# Altium schematic sheet MCU.SchDoc
size A3; DocumentNumber: 2; SheetNumber: 2; SheetTotal: 2
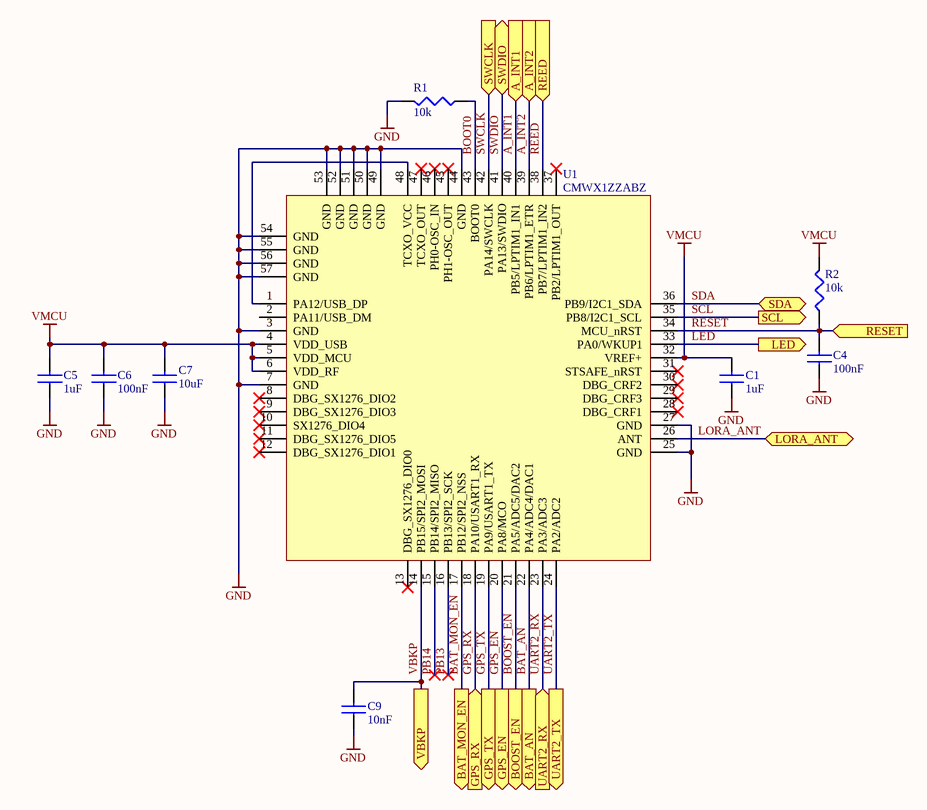
[diagram p0: MCU.SchDoc]

## Parts
C1  1uF  [CAP0402]
C4  100nF  [CAP0402]
C5  1uF  [CAP0402]
C6  100nF  [CAP0402]
C7  10uF  [CAP0603]
C9  10nF  [CAP0402]
R1  10k  [RES0402]
R2  10k  [RES0402]
U1  CMWX1ZZABZ  [Lora Module ES0]

## Ports
A_INT1 (in), A_INT2 (in), BAT_AN (out), BAT_MON_EN (out), BOOST_EN (out), GPS_EN (out), GPS_RX (in), GPS_TX (out), LED (out), LORA_ANT (bidir), REED (in), RESET (in), SCL (out), SDA (bidir), SWCLK (in), SWDIO (bidir), UART2_RX (in), UART2_TX (out), VBKP (out)

## Nets
GND: C1.1 C4.1 C5.1 C6.1 C7.1 C9.1 R1.2 U1.3(GND) U1.7(GND) U1.25(GND) U1.27(GND) U1.44(GND) U1.49(GND) U1.50(GND) U1.51(GND) U1.52(GND) U1.53(GND) U1.54(GND) U1.55(GND) U1.56(GND) U1.57(GND)
VMCU: C1.2 C5.2 C6.2 C7.2 R2.2 U1.4(VDD_USB) U1.5(VDD_MCU) U1.6(VDD_RF) U1.32(VREF+)
A_INT1: U1.40(PB5/LPTIM1_IN1) ; port A_INT1
A_INT2: U1.39(PB6/LPTIM1_ETR) ; port A_INT2
BAT_AN: U1.22(PA4/ADC4/DAC1) ; port BAT_AN
BAT_MON_EN: U1.17(PB12/SPI2_NSS) ; port BAT_MON_EN
BOOST_EN: U1.21(PA5/ADC5/DAC2) ; port BOOST_EN
BOOT0: R1.1 U1.43(BOOT0)
GPS_EN: U1.20(PA8/MCO) ; port GPS_EN
GPS_RX: U1.18(PA10/USART1_RX) ; port GPS_RX
GPS_TX: U1.19(PA9/USART1_TX) ; port GPS_TX
LED: U1.33(PA0/WKUP1) ; port LED
LORA_ANT: U1.26(ANT) ; port LORA_ANT
PB13: U1.16(PB13/SPI2_SCK)
PB14: U1.15(PB14/SPI2_MISO)
REED: U1.38(PB7/LPTIM1_IN2) ; port REED
RESET: C4.2 R2.1 U1.34(MCU_nRST) ; port RESET
SCL: U1.35(PB8/I2C1_SCL) ; port SCL
SDA: U1.36(PB9/I2C1_SDA) ; port SDA
SWCLK: U1.42(PA14/SWCLK) ; port SWCLK
SWDIO: U1.41(PA13/SWDIO) ; port SWDIO
UART2_RX: U1.23(PA3/ADC3) ; port UART2_RX
UART2_TX: U1.24(PA2/ADC2) ; port UART2_TX
VBKP: C9.2 U1.14(PB15/SPI2_MOSI) ; port VBKP
NetU1_1: U1.1(PA12/USB_DP) U1.48(TCXO_VCC)

Not connected (* = marked no-connect by the designer): U1 2(PA11/USB_DM) 8(DBG_SX1276_DIO2)* 9(DBG_SX1276_DIO3)* 10(SX1276_DIO4)* 11(DBG_SX1276_DIO5)* 12(DBG_SX1276_DIO1)* 13(DBG_SX1276_DIO0)* 28(DBG_CRF1)* 29(DBG_CRF3)* 30(DBG_CRF2)* 31(STSAFE_nRST)* 37(PB2/LPTIM1_OUT)* 45(PH1-OSC_OUT)* 46(PH0-OSC_IN)* 47(TCXO_OUT)*

## Notes on the sheet
- Size: A3
- Revision:
- Sheet
- of

## Library data of the parts
C1 C5 = C - 1uF/0402: CAP CER 1UF 10V 20% X5R 0402; Manufacturer: Murata; Manufacturer Part Number: GRM155R61A105ME15D; IRNAS Part No.: /; Stock 1: 0; Pricing 1: 10=0.0379, 100=0.0266, 500=0.0156, 2500=0.0098, 5000=0.0083 (EUR); Mount: Surface Mount; Case/Package: 0402; Case Code (Metric): 1005; Case Code (Imperial): 0402; Min Operating Temperature: -55°C; Max Operating Temperature: 85°C; Capacitance: 1uF; Tolerance: 20%; Voltage Rating: 10V; Packaging: Tape and Reel; Package Quantity: 1; Dielectric: X5R; Voltage: 10V; Voltage Rating (DC): 10V; Length: 1mm; Height: 0.5mm; Width: 0.02inch; Thickness: 0.022inch; Depth: 0.5mm; Radiation Hardening: No; REACH SVHC: No SVHC; Lead Free: Lead Free; ComponentLink1URL: https://datasheet.ciiva.com/164/product-164665.pdf; ComponentLink1Description: https://datasheet.ciiva.com/164/product-164665.pdf; ComponentLink2URL: https://datasheet.ciiva.com/11616/product-11616508.pdf; ComponentLink2Description: https://datasheet.ciiva.com/11616/product-11616508.pdf; ComponentLink3URL: https://datasheet.ciiva.com/46418/1769893-46418047.pdf; ComponentLink3Description: https://datasheet.ciiva.com/46418/1769893-46418047.pdf; ComponentLink4URL: https://datasheet.ciiva.com/164/partnumbering-e-01-164666.pdf; ComponentLink4Description: https://datasheet.ciiva.com/164/partnumbering-e-01-164666.pdf; ComponentLink5URL: https://datasheet.ciiva.com/164/partnumbering-e-01-164667.pdf; ComponentLink5Description: https://datasheet.ciiva.com/164/partnumbering-e-01-164667.pdf; Supplier 1: Farnell; Supplier Part Number 1: 1740588
C4 C6 = C - 100nF/0402: MULTICOMP         MC0402X104J160CT             SMD Multilayer Ceramic Capacitor, 0402 [1005 Metric], 0.1 F, 16 V,  5%, X5R, MC Series                          New; IRNAS Part No.: /; Voltage Rating: 16V; Supplier 1: Farnell; Manufacturer: Multicomp; Manufacturer Part Number: MC0402X104J160CT; Stock 1: 3230; Pricing 1: 10=0.0139, 100=0.0108, 500=0.0076, 2500=0.0051, 5000=0.0038 (EUR); Case Code (Metric): 1005; Case Code (Imperial): 0402; Min Operating Temperature: -55°C; Max Operating Temperature: 85°C; Capacitance: 100nF; Dielectric: X5R; Packaging: Tape and Reel; Tolerance: 5%; Voltage Rating (DC): 16V; REACH SVHC: No SVHC; ComponentLink1URL: http://www.farnell.com/datasheets/2117933.pdf; ComponentLink1Description: http://www.farnell.com/datasheets/2117933.pdf; ComponentLink2URL: http://www.farnell.com/datasheets/2117900.pdf; ComponentLink2Description: http://www.farnell.com/datasheets/2117900.pdf; Supplier Part Number 1: 2627419
C7 = 10uF: 10uf/0603/20%; Manufacturer: KEMET; Manufacturer Part Number: C0603C106M8PACTU; Stock 1: 0; Pricing 1: 10=0.555, 100=0.315, 500=0.238, 1000=0.2, 2000=0.174, 4000=0.143, 20000=0.123 (GBP); Supplier 1: Farnell; Supplier Part Number 1: 2456110
C9 = C - 10nF/0402: CAP CER 10000PF 16V X7R 0402; Manufacturer: Murata; Manufacturer Part Number: GRM155R71C103KA01D; IRNAS Part No.: /; Tolerance: 10%; Supplier 1: Farnell; Stock 1: 16478; Pricing 1: 10=0.0216, 100=0.0151, 500=0.0104, 2500=0.0069, 5000=0.0056 (EUR); Mount: Surface Mount; Case/Package: 0402; Number of Pins: 2; Case Code (Metric): 1005; Case Code (Imperial): 0402; Min Operating Temperature: -55°C; Max Operating Temperature: 125°C; Package Quantity: 1; Capacitance: 10nF; Voltage Rating: 16V; Packaging: Tape and Reel; Voltage Rating (DC): 16V; Dielectric: X7R; Termination: SMD/SMT; Voltage: 16V; Length: 1mm; Height: 0.5mm; Width: 0.02inch; Thickness: 0.022inch; Depth: 0.5mm; Radiation Hardening: No; REACH SVHC: No SVHC; Lead Free: Lead Free; ComponentLink1URL: https://datasheet.ciiva.com/129/partnumbering-e-01-129774.pdf; ComponentLink1Description: https://datasheet.ciiva.com/129/partnumbering-e-01-129774.pdf; ComponentLink2URL: https://datasheet.ciiva.com/129/partnumbering-e-01-129775.pdf; ComponentLink2Description: https://datasheet.ciiva.com/129/partnumbering-e-01-129775.pdf; ComponentLink3URL: https://datasheet.ciiva.com/129/product-129776.pdf; ComponentLink3Description: https://datasheet.ciiva.com/129/product-129776.pdf; ComponentLink4URL: https://datasheet.ciiva.com/18184/getdatasheetpartid-178863-18184649.pdf; ComponentLink4Description: https://datasheet.ciiva.com/18184/getdatasheetpartid-178863-18184649.pdf; ComponentLink5URL: https://datasheet.ciiva.com/22698/608985-22698415.pdf; ComponentLink5Description: https://datasheet.ciiva.com/22698/608985-22698415.pdf; ComponentLink6URL: https://datasheet.ciiva.com/7937/608985-7937614.pdf; ComponentLink6Description: https://datasheet.ciiva.com/7937/608985-7937614.pdf; Supplier Part Number 1: 1828864
R1 R2 = R - 10k/0402: MULTICOMP         MCWR04X1002FTL             SMD Chip Resistor, Thick Film, 10 kohm, 50 V, 0402 [1005 Metric], 62.5 mW,  1%, MCWR Series; IRNAS Part No.: I-100014; Resistance: 10kR; Voltage Rating: 50V; Power Rating: 62.5mW; Temperature Coefficient: 100ppm/°C; Supplier 1: Farnell; Manufacturer: Multicomp; Manufacturer Part Number: MCWR04X1002FTL; Stock 1: 602609; Pricing 1: 10=0.0029, 100=0.0017, 500=0.0012, 2500=0.001, 5000=0.0008 (EUR); Case/Package: 0402; Case Code (Metric): 1005; Case Code (Imperial): 0402; Packaging: Cut Tape; Composition: Thick Film; Tolerance: 1%; Voltage Rating (DC): 50V; REACH SVHC: No SVHC; ComponentLink1URL: http://www.farnell.com/datasheets/1849611.pdf; ComponentLink1Description: http://www.farnell.com/datasheets/1849611.pdf; Supplier Part Number 1: 2447096
U1 = MCU - CMWX1ZZABZ: RF Module, FSK, OOK, LoRa, 4.8Kbps, 915MHz, -135.5dBm, 2.2V to 3.6V, I2C, SPI, UART, USB; Manufacturer: Murata; Manufacturer Part Number: CMWX1ZZABZ-091; Stock 1: 175; Pricing 1: 1=11.7, 5=11.06, 10=9.94, 50=9.54, 100=9.14, 250=8.05 (GBP); ComponentLink1Description: Datasheet; ComponentLink1URL: D:\altium\Altium_Library\Active\Datasheet\CMWX1ZZABZ.pdf; Supplier 1: Farnell; Supplier Part Number 1: 2802546; Supplier 2: Mouser; Supplier Part Number 2: 81-CMWX1ZZABZ-091